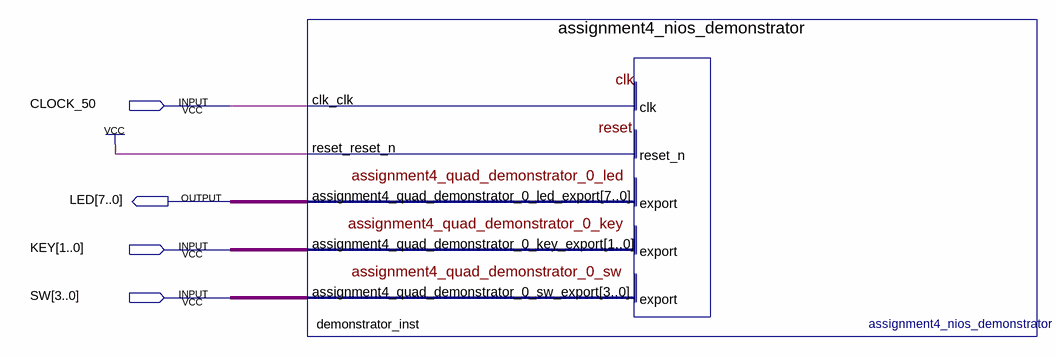
[diagram p0: schematic sheet]
// Quartus schematic assignment4_top.bdf as structural Verilog: 1 symbols, 4 pins
module assignment4_top (
  input  CLOCK_50,
  input  [1:0] KEY,
  input  [3:0] SW,
  output [7:0] LED
);

  assignment4_nios_demonstrator demonstrator_inst (
    .clk_clk(CLOCK_50), .reset_reset_n(1'b1), .assignment4_quad_demonstrator_0_key_export(KEY),
    .assignment4_quad_demonstrator_0_sw_export(SW), .assignment4_quad_demonstrator_0_led_export(LED));
endmodule
